# EAGLE schematic simple_encoder (EAGLE 7.6.0)
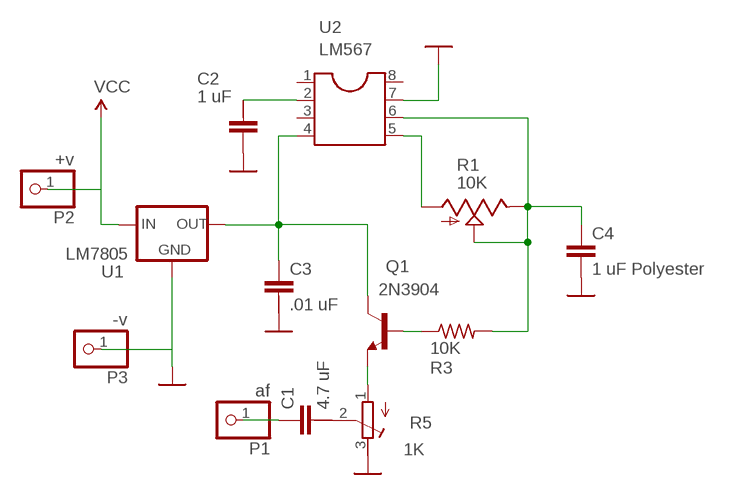
[diagram p0: schematic, sheet 1]

## Parts
C1  4.7 uF  C-2.5-5/4  [C2.5/5-4]
C2  1 uF  C-2.5-5/2  [C2.5/5-2]
C3  .01 uF  C-2.5-5/2  [C2.5/5-2]
C4  1 uF Polyester  C5/2.5  [C5B2.5]
P1  af  PINHD-1X1  [1X01]
P2  +v  PINHD-1X1  [1X01]
P3  -v  PINHD-1X1  [1X01]
Q1  2N3904  [TO92]
R1  10K  TRIM_US-S64W  [S64W]
R3  10K  R-US_0204/2V  [0204V]
R5  RTRIM-3362P  [RTRIM3362P]
U1  LM7805  78LXX  [78LXX]
U2  LM567  DIL8  [DIL08]

## Nets
GND: C2.1 C3.2 C4.2 P3.1 R5.3 U1.GND U2.7
N$1: C2.2 U2.2
N$2: C3.1 Q1.1(C) U1.OUT U2.4
N$3: R1.A U2.5
N$4: C4.1 R1.E R1.S R3.2 U2.6
N$5: Q1.2(B) R3.1
N$6: C1.2 R5.2
N$7: Q1.3(E) R5.1
N$8: C1.1 P1.1
VCC: P2.1 U1.IN
Unconnected: C1.3 C2.3 C3.3 U2.1 U2.3 U2.8

## Notes on the sheet
- 1K

## Library data of the parts
C1-C3 = capacitor-wima:C-: CAPACITOR for alternative placement naming: default grid - extended grid/package width
C4 = capacitor-wima:C: CAPACITOR naming: grid - package width
P1-P3 = pinhead:PINHD-1X1: PIN HEADER
Q1 = transistor:2N3904: NPN TRANSISTOR
R1 = pot:TRIM_US-: POTENTIOMETER
R3 = rcl:R-US_: RESISTOR, American symbol
R5 = GeekAmmo:RTRIM: BOURNS 3362 - 1/4" Square Trimpot® Trimming Potentiometer
U1 = v-reg:78LXX: VOLTAGE REGULATOR
U2 = ic-package:DIL8: Dual In Line / Socket